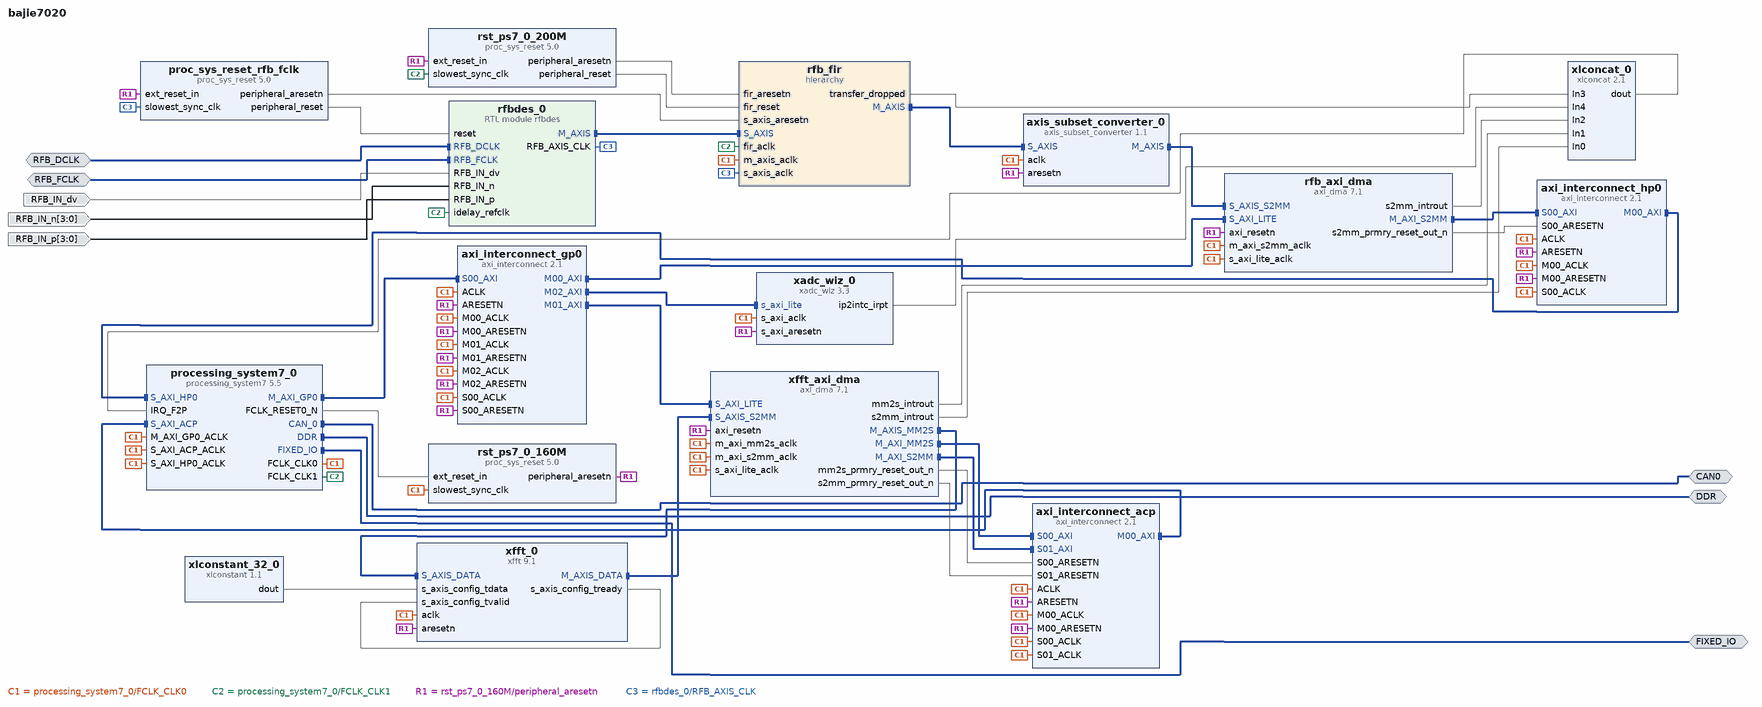
[diagram p0: block diagram of the top level]
# Vivado block design bajie7020, xc7z020clg400-1, Vivado 2022.1
create_bd_design bajie7020

create_bd_intf_port -mode Master -vlnv xilinx.com:interface:ddrx_rtl:1.0 DDR
create_bd_intf_port -mode Master -vlnv xilinx.com:display_processing_system7:fixedio_rtl:1.0 FIXED_IO
create_bd_intf_port -mode Master -vlnv xilinx.com:interface:can_rtl:1.0 CAN0
create_bd_intf_port -mode Slave -vlnv xilinx.com:interface:diff_clock_rtl:1.0 RFB_DCLK
set_property -dict {CONFIG.FREQ_HZ 144000000} [get_bd_intf_ports RFB_DCLK]
create_bd_intf_port -mode Slave -vlnv xilinx.com:interface:diff_clock_rtl:1.0 RFB_FCLK
set_property -dict {CONFIG.FREQ_HZ 48000000} [get_bd_intf_ports RFB_FCLK]
create_bd_port -dir I RFB_IN_dv
create_bd_port -dir I -from 3 -to 0 RFB_IN_n
create_bd_port -dir I -from 3 -to 0 RFB_IN_p

create_bd_cell -type ip -vlnv xilinx.com:ip:processing_system7:5.5 processing_system7_0
set_property -dict [list \
  CONFIG.PCW_APU_PERIPHERAL_FREQMHZ 666.666666 \
  CONFIG.PCW_CAN0_CAN0_IO EMIO \
  CONFIG.PCW_CAN0_PERIPHERAL_ENABLE 1 \
  CONFIG.PCW_CAN_PERIPHERAL_FREQMHZ 24 \
  CONFIG.PCW_CRYSTAL_PERIPHERAL_FREQMHZ 33.33333333 \
  CONFIG.PCW_ENET0_ENET0_IO {MIO 16 .. 27} \
  CONFIG.PCW_ENET0_GRP_MDIO_ENABLE 1 \
  CONFIG.PCW_ENET0_GRP_MDIO_IO {MIO 52 .. 53} \
  CONFIG.PCW_ENET0_PERIPHERAL_ENABLE 1 \
  CONFIG.PCW_ENET0_RESET_ENABLE 0 \
  CONFIG.PCW_ENET_RESET_ENABLE 1 \
  CONFIG.PCW_ENET_RESET_SELECT {Share reset pin} \
  CONFIG.PCW_EN_CLK1_PORT 1 \
  CONFIG.PCW_FCLK0_PERIPHERAL_CLKSRC {ARM PLL} \
  CONFIG.PCW_FCLK_CLK1_BUF TRUE \
  CONFIG.PCW_FPGA0_PERIPHERAL_FREQMHZ 133.33333333 \
  CONFIG.PCW_FPGA1_PERIPHERAL_FREQMHZ 200 \
  CONFIG.PCW_FPGA2_PERIPHERAL_FREQMHZ 100 \
  CONFIG.PCW_FPGA_FCLK1_ENABLE 1 \
  CONFIG.PCW_GPIO_EMIO_GPIO_ENABLE 1 \
  CONFIG.PCW_GPIO_EMIO_GPIO_IO 1 \
  CONFIG.PCW_GPIO_EMIO_GPIO_WIDTH 1 \
  CONFIG.PCW_GPIO_MIO_GPIO_ENABLE 1 \
  CONFIG.PCW_GPIO_MIO_GPIO_IO MIO \
  CONFIG.PCW_I2C_RESET_ENABLE 1 \
  CONFIG.PCW_IRQ_F2P_INTR 1 \
  CONFIG.PCW_PERIPHERAL_BOARD_PRESET None \
  CONFIG.PCW_PRESET_BANK1_VOLTAGE {LVCMOS 1.8V} \
  CONFIG.PCW_QSPI_PERIPHERAL_ENABLE 0 \
  CONFIG.PCW_SD0_GRP_CD_ENABLE 1 \
  CONFIG.PCW_SD0_GRP_CD_IO {MIO 47} \
  CONFIG.PCW_SD0_GRP_WP_ENABLE 0 \
  CONFIG.PCW_SD0_PERIPHERAL_ENABLE 1 \
  CONFIG.PCW_SD0_SD0_IO {MIO 40 .. 45} \
  CONFIG.PCW_SDIO_PERIPHERAL_FREQMHZ 50 \
  CONFIG.PCW_UART1_PERIPHERAL_ENABLE 1 \
  CONFIG.PCW_UART1_UART1_IO {MIO 12 .. 13} \
  CONFIG.PCW_UART_PERIPHERAL_FREQMHZ 100 \
  CONFIG.PCW_UIPARAM_DDR_BUS_WIDTH {16 Bit} \
  CONFIG.PCW_UIPARAM_DDR_FREQ_MHZ 400 \
  CONFIG.PCW_UIPARAM_DDR_PARTNO {MT41K256M16 RE-125} \
  CONFIG.PCW_USB0_PERIPHERAL_ENABLE 0 \
  CONFIG.PCW_USB_RESET_ENABLE 1 \
  CONFIG.PCW_USE_FABRIC_INTERRUPT 1 \
  CONFIG.PCW_USE_S_AXI_ACP 1 \
  CONFIG.PCW_USE_S_AXI_HP0 1 \
] [get_bd_cells processing_system7_0]
# 507 more settings of processing_system7_0 are not shown: defaults, MIO pin electricals, DDR timing, and values the tool derives
create_bd_cell -type ip -vlnv xilinx.com:ip:proc_sys_reset:5.0 rst_ps7_0_160M
create_bd_cell -type ip -vlnv xilinx.com:ip:xlconcat:2.1 xlconcat_0
set_property -dict {CONFIG.NUM_PORTS 5} [get_bd_cells xlconcat_0]
create_bd_cell -type ip -vlnv xilinx.com:ip:proc_sys_reset:5.0 proc_sys_reset_rfb_fclk
create_bd_cell -type ip -vlnv xilinx.com:ip:proc_sys_reset:5.0 rst_ps7_0_200M
create_bd_cell -type hier rfb_fir
create_bd_cell -type ip -vlnv xilinx.com:ip:xadc_wiz:3.3 xadc_wiz_0
set_property -dict [list \
  CONFIG.ADC_CONVERSION_RATE 1000 \
  CONFIG.ADC_OFFSET_CALIBRATION false \
  CONFIG.CHANNEL_ENABLE_TEMPERATURE true \
  CONFIG.CHANNEL_ENABLE_VCCAUX false \
  CONFIG.CHANNEL_ENABLE_VCCINT false \
  CONFIG.CHANNEL_ENABLE_VP_VN false \
  CONFIG.DCLK_FREQUENCY 160 \
  CONFIG.ENABLE_TEMP_BUS false \
  CONFIG.ENABLE_VBRAM_ALARM true \
  CONFIG.EXTERNAL_MUX_CHANNEL VP_VN \
  CONFIG.POWER_DOWN_ADCB false \
  CONFIG.SEQUENCER_MODE Off \
  CONFIG.SINGLE_CHANNEL_SELECTION TEMPERATURE \
  CONFIG.VCCDDRO_ALARM_UPPER 1.35 \
  CONFIG.VCCDDRO_VOLT 1_35 \
  CONFIG.XADC_STARUP_SELECTION simultaneous_sampling \
] [get_bd_cells xadc_wiz_0]
create_bd_cell -type ip -vlnv xilinx.com:ip:axi_dma:7.1 rfb_axi_dma
set_property -dict [list \
  CONFIG.c_include_mm2s 0 \
  CONFIG.c_include_sg 0 \
  CONFIG.c_m_axi_s2mm_data_width 64 \
  CONFIG.c_s_axis_s2mm_tdata_width 64 \
  CONFIG.c_sg_length_width 20 \
] [get_bd_cells rfb_axi_dma]
create_bd_cell -type ip -vlnv xilinx.com:ip:axi_dma:7.1 xfft_axi_dma
set_property -dict [list \
  CONFIG.c_include_sg 0 \
  CONFIG.c_m_axi_mm2s_data_width 64 \
  CONFIG.c_m_axi_s2mm_data_width 64 \
  CONFIG.c_m_axis_mm2s_tdata_width 64 \
  CONFIG.c_mm2s_burst_size 8 \
  CONFIG.c_s_axis_s2mm_tdata_width 64 \
  CONFIG.c_sg_length_width 20 \
] [get_bd_cells xfft_axi_dma]
create_bd_cell -type ip -vlnv xilinx.com:ip:axi_interconnect:2.1 axi_interconnect_gp0
set_property -dict {CONFIG.ENABLE_ADVANCED_OPTIONS 1 CONFIG.NUM_MI 3 CONFIG.NUM_SI 1} [get_bd_cells axi_interconnect_gp0]
create_bd_cell -type ip -vlnv xilinx.com:ip:axi_interconnect:2.1 axi_interconnect_acp
set_property -dict [list \
  CONFIG.ENABLE_ADVANCED_OPTIONS 1 \
  CONFIG.NUM_MI 1 \
  CONFIG.NUM_SI 2 \
  CONFIG.S00_ARB_PRIORITY 1 \
  CONFIG.S01_ARB_PRIORITY 2 \
  CONFIG.XBAR_DATA_WIDTH 64 \
] [get_bd_cells axi_interconnect_acp]
create_bd_cell -type ip -vlnv xilinx.com:ip:axi_interconnect:2.1 axi_interconnect_hp0
set_property -dict [list \
  CONFIG.ENABLE_ADVANCED_OPTIONS 1 \
  CONFIG.NUM_MI 1 \
  CONFIG.NUM_SI 1 \
  CONFIG.S00_HAS_DATA_FIFO 0 \
  CONFIG.XBAR_DATA_WIDTH 64 \
] [get_bd_cells axi_interconnect_hp0]
create_bd_cell -type ip -vlnv xilinx.com:ip:axis_subset_converter:1.1 axis_subset_converter_0
set_property -dict [list \
  CONFIG.M_HAS_TKEEP 1 \
  CONFIG.M_HAS_TLAST 1 \
  CONFIG.M_HAS_TREADY 1 \
  CONFIG.M_HAS_TSTRB 0 \
  CONFIG.M_TDATA_NUM_BYTES 8 \
  CONFIG.M_TDEST_WIDTH 0 \
  CONFIG.M_TID_WIDTH 0 \
  CONFIG.M_TUSER_WIDTH 0 \
  CONFIG.S_HAS_TKEEP 0 \
  CONFIG.S_HAS_TLAST 1 \
  CONFIG.S_HAS_TREADY 1 \
  CONFIG.S_HAS_TSTRB 0 \
  CONFIG.S_TDATA_NUM_BYTES 8 \
  CONFIG.S_TDEST_WIDTH 0 \
  CONFIG.S_TID_WIDTH 0 \
  CONFIG.S_TUSER_WIDTH 0 \
  CONFIG.TDATA_REMAP {tdata[63:0]} \
  CONFIG.TKEEP_REMAP {8'b11111111} \
  CONFIG.TLAST_REMAP {tlast[0]} \
] [get_bd_cells axis_subset_converter_0]
create_bd_cell -type ip -vlnv xilinx.com:ip:xfft:9.1 xfft_0
set_property -dict [list \
  CONFIG.aresetn true \
  CONFIG.channels 2 \
  CONFIG.complex_mult_type use_mults_resources \
  CONFIG.data_format fixed_point \
  CONFIG.implementation_options radix_4_burst_io \
  CONFIG.input_width 16 \
  CONFIG.memory_options_hybrid false \
  CONFIG.number_of_stages_using_block_ram_for_data_and_phase_factors 0 \
  CONFIG.output_ordering natural_order \
  CONFIG.phase_factor_width 16 \
  CONFIG.rounding_modes convergent_rounding \
  CONFIG.run_time_configurable_transform_length false \
  CONFIG.scaling_options scaled \
  CONFIG.target_clock_frequency 133 \
  CONFIG.target_data_throughput 50 \
  CONFIG.throttle_scheme nonrealtime \
  CONFIG.transform_length 4096 \
] [get_bd_cells xfft_0]
create_bd_cell -type ip -vlnv xilinx.com:ip:xlconstant:1.1 xlconstant_32_0
set_property -dict {CONFIG.CONST_VAL 0 CONFIG.CONST_WIDTH 32} [get_bd_cells xlconstant_32_0]
create_bd_cell -type module -reference rfbdes rfbdes_0
set_property -dict {CONFIG.din_idelay_tap 12} [get_bd_cells rfbdes_0]

# ---- hierarchy /rfb_fir ----
current_bd_instance /rfb_fir
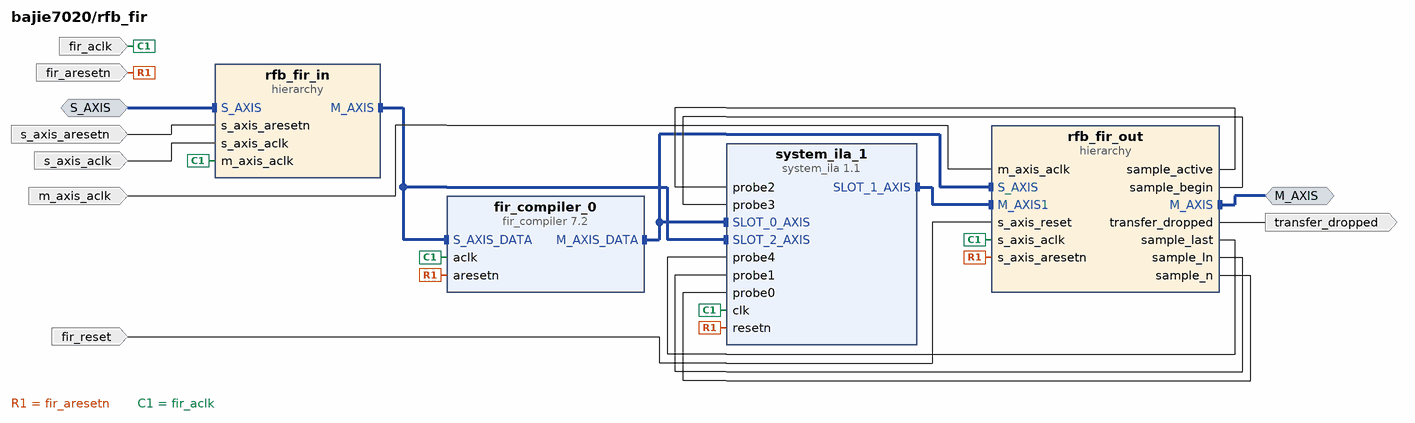
[diagram p1: block diagram inside /rfb_fir]
create_bd_intf_pin -mode Slave -vlnv xilinx.com:interface:axis_rtl:1.0 S_AXIS
create_bd_intf_pin -mode Master -vlnv xilinx.com:interface:axis_rtl:1.0 M_AXIS
create_bd_pin -dir I -type rst fir_aresetn
create_bd_pin -dir I -type clk fir_aclk
create_bd_pin -dir I -type clk m_axis_aclk
create_bd_pin -dir I -type clk s_axis_aclk
create_bd_pin -dir I -type rst s_axis_aresetn
create_bd_pin -dir O transfer_dropped
create_bd_pin -dir I -type rst fir_reset

create_bd_cell -type hier rfb_fir_out
create_bd_cell -type hier rfb_fir_in
create_bd_cell -type ip -vlnv xilinx.com:ip:fir_compiler:7.2 fir_compiler_0
set_property -dict [list \
  CONFIG.BestPrecision true \
  CONFIG.Clock_Frequency 200 \
  CONFIG.CoefficientSource COE_File \
  CONFIG.Coefficient_File ../../../../new/fir48Mt2M4.coe \
  CONFIG.Coefficient_Fractional_Bits 20 \
  CONFIG.Coefficient_Sets 1 \
  CONFIG.Coefficient_Sign Signed \
  CONFIG.Coefficient_Structure Inferred \
  CONFIG.Coefficient_Width 18 \
  CONFIG.ColumnConfig 8 \
  CONFIG.DATA_TUSER_Width 1 \
  CONFIG.Data_Fractional_Bits 0 \
  CONFIG.Data_Sign Signed \
  CONFIG.Data_Width 12 \
  CONFIG.Filter_Architecture Systolic_Multiply_Accumulate \
  CONFIG.Has_ACLKEN false \
  CONFIG.Has_ARESETn true \
  CONFIG.M_DATA_Has_TUSER User_Field \
  CONFIG.Number_Paths 2 \
  CONFIG.Output_Rounding_Mode Truncate_LSBs \
  CONFIG.Output_Width 32 \
  CONFIG.Quantization Maximize_Dynamic_Range \
  CONFIG.Reset_Data_Vector false \
  CONFIG.S_DATA_Has_FIFO false \
  CONFIG.S_DATA_Has_TUSER User_Field \
  CONFIG.Sample_Frequency 48 \
] [get_bd_cells fir_compiler_0]
create_bd_cell -type ip -vlnv xilinx.com:ip:system_ila:1.1 system_ila_1
set_property -dict [list \
  CONFIG.ALL_PROBE_SAME_MU_CNT 2 \
  CONFIG.C_DATA_DEPTH 4096 \
  CONFIG.C_EN_STRG_QUAL 1 \
  CONFIG.C_MON_TYPE MIX \
  CONFIG.C_NUM_MONITOR_SLOTS 3 \
  CONFIG.C_NUM_OF_PROBES 5 \
  CONFIG.C_PROBE0_MU_CNT 2 \
  CONFIG.C_PROBE1_MU_CNT 2 \
  CONFIG.C_PROBE2_MU_CNT 2 \
  CONFIG.C_PROBE3_MU_CNT 2 \
  CONFIG.C_PROBE4_MU_CNT 2 \
  CONFIG.C_PROBE5_MU_CNT 2 \
  CONFIG.C_SLOT 2 \
  CONFIG.C_SLOT_0_INTF_TYPE xilinx.com:interface:axis_rtl:1.0 \
  CONFIG.C_SLOT_1_INTF_TYPE xilinx.com:interface:axis_rtl:1.0 \
  CONFIG.C_SLOT_2_INTF_TYPE xilinx.com:interface:axis_rtl:1.0 \
] [get_bd_cells system_ila_1]

# ---- hierarchy /rfb_fir/rfb_fir_out ----
current_bd_instance /rfb_fir/rfb_fir_out
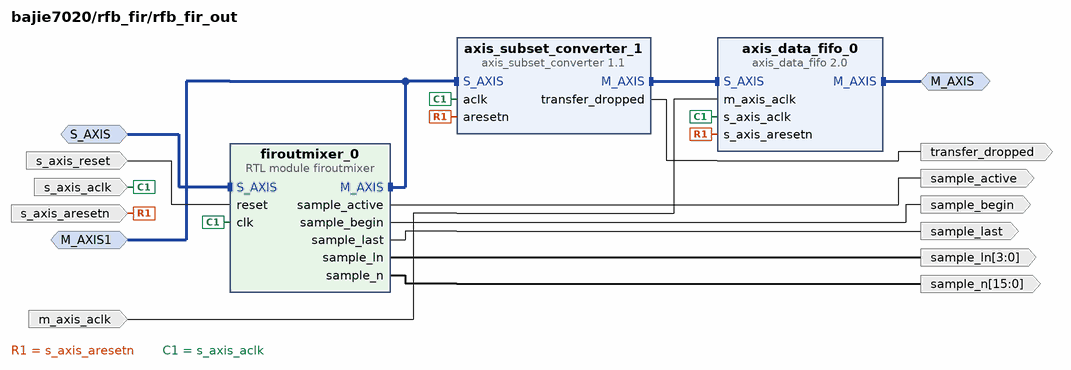
[diagram p2: block diagram inside /rfb_fir/rfb_fir_out]
create_bd_intf_pin -mode Slave -vlnv xilinx.com:interface:axis_rtl:1.0 S_AXIS
create_bd_intf_pin -mode Master -vlnv xilinx.com:interface:axis_rtl:1.0 M_AXIS
create_bd_intf_pin -mode Monitor -vlnv xilinx.com:interface:axis_rtl:1.0 M_AXIS1
create_bd_pin -dir I -type clk s_axis_aclk
create_bd_pin -dir I -type rst s_axis_aresetn
create_bd_pin -dir I -type clk m_axis_aclk
create_bd_pin -dir O transfer_dropped
create_bd_pin -dir I -type rst s_axis_reset
create_bd_pin -dir O sample_last
create_bd_pin -dir O sample_active
create_bd_pin -dir O sample_begin
create_bd_pin -dir O -from 15 -to 0 sample_n
create_bd_pin -dir O -from 3 -to 0 sample_ln

create_bd_cell -type ip -vlnv xilinx.com:ip:axis_data_fifo:2.0 axis_data_fifo_0
set_property -dict [list \
  CONFIG.FIFO_DEPTH 1024 \
  CONFIG.HAS_TKEEP 0 \
  CONFIG.HAS_TLAST 1 \
  CONFIG.HAS_TSTRB 0 \
  CONFIG.IS_ACLK_ASYNC 1 \
  CONFIG.TDATA_NUM_BYTES 8 \
  CONFIG.TDEST_WIDTH 0 \
  CONFIG.TID_WIDTH 0 \
  CONFIG.TUSER_WIDTH 0 \
] [get_bd_cells axis_data_fifo_0]
create_bd_cell -type ip -vlnv xilinx.com:ip:axis_subset_converter:1.1 axis_subset_converter_1
set_property -dict [list \
  CONFIG.M_HAS_TKEEP 0 \
  CONFIG.M_HAS_TLAST 1 \
  CONFIG.M_HAS_TREADY 1 \
  CONFIG.M_HAS_TSTRB 0 \
  CONFIG.M_TDATA_NUM_BYTES 8 \
  CONFIG.M_TDEST_WIDTH 0 \
  CONFIG.M_TID_WIDTH 0 \
  CONFIG.M_TUSER_WIDTH 0 \
  CONFIG.S_HAS_TKEEP 0 \
  CONFIG.S_HAS_TLAST 1 \
  CONFIG.S_HAS_TREADY 0 \
  CONFIG.S_HAS_TSTRB 0 \
  CONFIG.S_TDATA_NUM_BYTES 8 \
  CONFIG.S_TDEST_WIDTH 0 \
  CONFIG.S_TID_WIDTH 0 \
  CONFIG.S_TUSER_WIDTH 0 \
  CONFIG.TDATA_REMAP {tdata[63:0]} \
  CONFIG.TLAST_REMAP {tlast[0]} \
] [get_bd_cells axis_subset_converter_1]
create_bd_cell -type module -reference firoutmixer firoutmixer_0

# ---- hierarchy /rfb_fir/rfb_fir_in ----
current_bd_instance /rfb_fir/rfb_fir_in
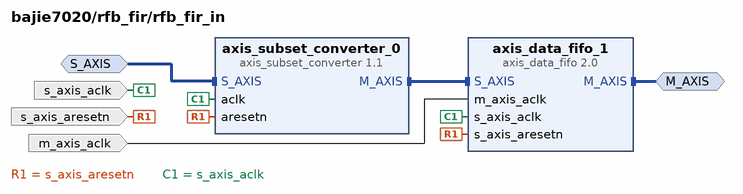
[diagram p3: block diagram inside /rfb_fir/rfb_fir_in]
create_bd_intf_pin -mode Slave -vlnv xilinx.com:interface:axis_rtl:1.0 S_AXIS
create_bd_intf_pin -mode Master -vlnv xilinx.com:interface:axis_rtl:1.0 M_AXIS
create_bd_pin -dir I -type clk s_axis_aclk
create_bd_pin -dir I -type rst s_axis_aresetn
create_bd_pin -dir I -type clk m_axis_aclk

create_bd_cell -type ip -vlnv xilinx.com:ip:axis_data_fifo:2.0 axis_data_fifo_1
set_property -dict {CONFIG.FIFO_DEPTH 16 CONFIG.FIFO_MEMORY_TYPE auto CONFIG.IS_ACLK_ASYNC 1} [get_bd_cells axis_data_fifo_1]
create_bd_cell -type ip -vlnv xilinx.com:ip:axis_subset_converter:1.1 axis_subset_converter_0
set_property -dict [list \
  CONFIG.M_HAS_TKEEP 0 \
  CONFIG.M_HAS_TLAST 0 \
  CONFIG.M_HAS_TREADY 1 \
  CONFIG.M_HAS_TSTRB 0 \
  CONFIG.M_TDATA_NUM_BYTES 4 \
  CONFIG.M_TDEST_WIDTH 0 \
  CONFIG.M_TID_WIDTH 0 \
  CONFIG.M_TUSER_WIDTH 1 \
  CONFIG.S_HAS_TKEEP 0 \
  CONFIG.S_HAS_TLAST 0 \
  CONFIG.S_HAS_TREADY 0 \
  CONFIG.S_HAS_TSTRB 0 \
  CONFIG.S_TDATA_NUM_BYTES 3 \
  CONFIG.S_TDEST_WIDTH 0 \
  CONFIG.S_TID_WIDTH 0 \
  CONFIG.S_TUSER_WIDTH 1 \
  CONFIG.TDATA_REMAP {4'b0000,tdata[23:12],4'b0000,tdata[11:0]} \
  CONFIG.TKEEP_REMAP {1'b0} \
  CONFIG.TLAST_REMAP {1'b0} \
  CONFIG.TUSER_REMAP {tuser[0:0]} \
] [get_bd_cells axis_subset_converter_0]

# ---- connections ----

current_bd_instance /rfb_fir
connect_bd_intf_net [get_bd_intf_pins system_ila_1/SLOT_1_AXIS] [get_bd_intf_pins rfb_fir_out/M_AXIS1]
connect_bd_intf_net [get_bd_intf_pins M_AXIS] [get_bd_intf_pins rfb_fir_out/M_AXIS]
connect_bd_intf_net -intf_net axis_data_fifo_1_M_AXIS [get_bd_intf_pins rfb_fir_in/M_AXIS] [get_bd_intf_pins fir_compiler_0/S_AXIS_DATA]
connect_bd_intf_net [get_bd_intf_pins rfb_fir_in/M_AXIS] [get_bd_intf_pins system_ila_1/SLOT_2_AXIS]
connect_bd_intf_net [get_bd_intf_pins fir_compiler_0/M_AXIS_DATA] [get_bd_intf_pins rfb_fir_out/S_AXIS]
connect_bd_intf_net [get_bd_intf_pins fir_compiler_0/M_AXIS_DATA] [get_bd_intf_pins system_ila_1/SLOT_0_AXIS]
connect_bd_intf_net -intf_net rfbdes_0_M_AXIS [get_bd_intf_pins S_AXIS] [get_bd_intf_pins rfb_fir_in/S_AXIS]
connect_bd_net -net proc_sys_reset_rfb_288M_peripheral_aresetn [get_bd_pins fir_aresetn] \
  [get_bd_pins rfb_fir_out/s_axis_aresetn] [get_bd_pins fir_compiler_0/aresetn] [get_bd_pins system_ila_1/resetn]
connect_bd_net -net proc_sys_reset_rfb_fclk_peripheral_aresetn [get_bd_pins s_axis_aresetn] [get_bd_pins rfb_fir_in/s_axis_aresetn]
connect_bd_net -net processing_system7_0_FCLK_CLK0 [get_bd_pins m_axis_aclk] [get_bd_pins rfb_fir_out/m_axis_aclk]
connect_bd_net -net processing_system7_0_FCLK_CLK1 [get_bd_pins fir_aclk] \
  [get_bd_pins rfb_fir_in/m_axis_aclk] [get_bd_pins rfb_fir_out/s_axis_aclk] [get_bd_pins fir_compiler_0/aclk] \
  [get_bd_pins system_ila_1/clk]
connect_bd_net -net reset_1 [get_bd_pins fir_reset] [get_bd_pins rfb_fir_out/s_axis_reset]
connect_bd_net [get_bd_pins rfb_fir_out/sample_active] [get_bd_pins system_ila_1/probe2]
connect_bd_net [get_bd_pins rfb_fir_out/sample_begin] [get_bd_pins system_ila_1/probe3]
connect_bd_net [get_bd_pins rfb_fir_out/sample_last] [get_bd_pins system_ila_1/probe4]
connect_bd_net [get_bd_pins rfb_fir_out/sample_ln] [get_bd_pins system_ila_1/probe1]
connect_bd_net [get_bd_pins rfb_fir_out/sample_n] [get_bd_pins system_ila_1/probe0]
connect_bd_net [get_bd_pins rfb_fir_out/transfer_dropped] [get_bd_pins transfer_dropped]
connect_bd_net -net util_ds_buf_rfb_fclk_IBUF_OUT [get_bd_pins s_axis_aclk] [get_bd_pins rfb_fir_in/s_axis_aclk]

current_bd_instance /rfb_fir/rfb_fir_out
connect_bd_intf_net [get_bd_intf_pins M_AXIS] [get_bd_intf_pins axis_data_fifo_0/M_AXIS]
connect_bd_intf_net [get_bd_intf_pins axis_data_fifo_0/S_AXIS] [get_bd_intf_pins axis_subset_converter_1/M_AXIS]
connect_bd_intf_net -intf_net fir_compiler_0_M_AXIS_DATA [get_bd_intf_pins S_AXIS] [get_bd_intf_pins firoutmixer_0/S_AXIS]
connect_bd_intf_net [get_bd_intf_pins firoutmixer_0/M_AXIS] [get_bd_intf_pins axis_subset_converter_1/S_AXIS]
connect_bd_intf_net [get_bd_intf_pins firoutmixer_0/M_AXIS] [get_bd_intf_pins M_AXIS1]
connect_bd_net [get_bd_pins axis_subset_converter_1/transfer_dropped] [get_bd_pins transfer_dropped]
connect_bd_net [get_bd_pins firoutmixer_0/sample_active] [get_bd_pins sample_active]
connect_bd_net [get_bd_pins firoutmixer_0/sample_begin] [get_bd_pins sample_begin]
connect_bd_net [get_bd_pins firoutmixer_0/sample_last] [get_bd_pins sample_last]
connect_bd_net [get_bd_pins firoutmixer_0/sample_ln] [get_bd_pins sample_ln]
connect_bd_net [get_bd_pins firoutmixer_0/sample_n] [get_bd_pins sample_n]
connect_bd_net -net proc_sys_reset_rfb_288M_peripheral_aresetn [get_bd_pins s_axis_aresetn] \
  [get_bd_pins axis_data_fifo_0/s_axis_aresetn] [get_bd_pins axis_subset_converter_1/aresetn]
connect_bd_net -net processing_system7_0_FCLK_CLK0 [get_bd_pins m_axis_aclk] [get_bd_pins axis_data_fifo_0/m_axis_aclk]
connect_bd_net -net processing_system7_0_FCLK_CLK1 [get_bd_pins s_axis_aclk] \
  [get_bd_pins axis_data_fifo_0/s_axis_aclk] [get_bd_pins axis_subset_converter_1/aclk] [get_bd_pins firoutmixer_0/clk]
connect_bd_net -net reset_1 [get_bd_pins s_axis_reset] [get_bd_pins firoutmixer_0/reset]

current_bd_instance /rfb_fir/rfb_fir_in
connect_bd_intf_net [get_bd_intf_pins M_AXIS] [get_bd_intf_pins axis_data_fifo_1/M_AXIS]
connect_bd_intf_net [get_bd_intf_pins axis_data_fifo_1/S_AXIS] [get_bd_intf_pins axis_subset_converter_0/M_AXIS]
connect_bd_intf_net -intf_net rfbdes_0_M_AXIS [get_bd_intf_pins S_AXIS] [get_bd_intf_pins axis_subset_converter_0/S_AXIS]
connect_bd_net -net proc_sys_reset_rfb_fclk_peripheral_aresetn [get_bd_pins s_axis_aresetn] \
  [get_bd_pins axis_data_fifo_1/s_axis_aresetn] [get_bd_pins axis_subset_converter_0/aresetn]
connect_bd_net -net processing_system7_0_FCLK_CLK1 [get_bd_pins m_axis_aclk] [get_bd_pins axis_data_fifo_1/m_axis_aclk]
connect_bd_net -net util_ds_buf_rfb_fclk_IBUF_OUT [get_bd_pins s_axis_aclk] \
  [get_bd_pins axis_data_fifo_1/s_axis_aclk] [get_bd_pins axis_subset_converter_0/aclk]

current_bd_instance /
connect_bd_intf_net [get_bd_intf_ports RFB_DCLK] [get_bd_intf_pins rfbdes_0/RFB_DCLK]
connect_bd_intf_net [get_bd_intf_ports RFB_FCLK] [get_bd_intf_pins rfbdes_0/RFB_FCLK]
connect_bd_intf_net [get_bd_intf_pins axi_interconnect_gp0/S00_AXI] [get_bd_intf_pins processing_system7_0/M_AXI_GP0]
connect_bd_intf_net [get_bd_intf_pins axi_interconnect_hp0/S00_AXI] [get_bd_intf_pins rfb_axi_dma/M_AXI_S2MM]
connect_bd_intf_net -intf_net axi_dma_1_M_AXIS_MM2S [get_bd_intf_pins xfft_0/S_AXIS_DATA] [get_bd_intf_pins xfft_axi_dma/M_AXIS_MM2S]
connect_bd_intf_net -intf_net axi_dma_1_M_AXI_MM2S [get_bd_intf_pins xfft_axi_dma/M_AXI_MM2S] [get_bd_intf_pins axi_interconnect_acp/S00_AXI]
connect_bd_intf_net -intf_net axi_dma_1_M_AXI_S2MM [get_bd_intf_pins xfft_axi_dma/M_AXI_S2MM] [get_bd_intf_pins axi_interconnect_acp/S01_AXI]
connect_bd_intf_net -intf_net axi_interconnect_0_M00_AXI [get_bd_intf_pins axi_interconnect_gp0/M00_AXI] [get_bd_intf_pins rfb_axi_dma/S_AXI_LITE]
connect_bd_intf_net -intf_net axi_interconnect_0_M01_AXI [get_bd_intf_pins xfft_axi_dma/S_AXI_LITE] [get_bd_intf_pins axi_interconnect_gp0/M01_AXI]
connect_bd_intf_net -intf_net axi_interconnect_1_M00_AXI [get_bd_intf_pins axi_interconnect_acp/M00_AXI] [get_bd_intf_pins processing_system7_0/S_AXI_ACP]
connect_bd_intf_net [get_bd_intf_pins axi_interconnect_gp0/M02_AXI] [get_bd_intf_pins xadc_wiz_0/s_axi_lite]
connect_bd_intf_net -intf_net axi_mem_intercon_M00_AXI [get_bd_intf_pins axi_interconnect_hp0/M00_AXI] [get_bd_intf_pins processing_system7_0/S_AXI_HP0]
connect_bd_intf_net [get_bd_intf_pins rfb_axi_dma/S_AXIS_S2MM] [get_bd_intf_pins axis_subset_converter_0/M_AXIS]
connect_bd_intf_net [get_bd_intf_ports CAN0] [get_bd_intf_pins processing_system7_0/CAN_0]
connect_bd_intf_net [get_bd_intf_ports DDR] [get_bd_intf_pins processing_system7_0/DDR]
connect_bd_intf_net [get_bd_intf_ports FIXED_IO] [get_bd_intf_pins processing_system7_0/FIXED_IO]
connect_bd_intf_net [get_bd_intf_pins axis_subset_converter_0/S_AXIS] [get_bd_intf_pins rfb_fir/M_AXIS]
connect_bd_intf_net [get_bd_intf_pins rfbdes_0/M_AXIS] [get_bd_intf_pins rfb_fir/S_AXIS]
connect_bd_intf_net [get_bd_intf_pins xfft_0/M_AXIS_DATA] [get_bd_intf_pins xfft_axi_dma/S_AXIS_S2MM]
connect_bd_net -net RFB_DATAVALID_1 [get_bd_ports RFB_IN_dv] [get_bd_pins rfbdes_0/RFB_IN_dv]
connect_bd_net -net RFB_IN_n_0_1 [get_bd_ports RFB_IN_n] [get_bd_pins rfbdes_0/RFB_IN_n]
connect_bd_net -net RFB_IN_p_0_1 [get_bd_ports RFB_IN_p] [get_bd_pins rfbdes_0/RFB_IN_p]
connect_bd_net -net axi_dma_1_mm2s_introut [get_bd_pins xfft_axi_dma/mm2s_introut] [get_bd_pins xlconcat_0/In1]
connect_bd_net -net axi_dma_1_mm2s_prmry_reset_out_n [get_bd_pins xfft_axi_dma/mm2s_prmry_reset_out_n] [get_bd_pins axi_interconnect_acp/S00_ARESETN]
connect_bd_net -net axi_dma_1_s2mm_introut [get_bd_pins xfft_axi_dma/s2mm_introut] [get_bd_pins xlconcat_0/In0]
connect_bd_net -net axi_dma_1_s2mm_prmry_reset_out_n [get_bd_pins xfft_axi_dma/s2mm_prmry_reset_out_n] [get_bd_pins axi_interconnect_acp/S01_ARESETN]
connect_bd_net -net hdmi_axi_dma_0_s2mm_introut [get_bd_pins rfb_axi_dma/s2mm_introut] [get_bd_pins xlconcat_0/In2]
connect_bd_net -net hdmi_axi_dma_0_s2mm_prmry_reset_out_n [get_bd_pins rfb_axi_dma/s2mm_prmry_reset_out_n] \
  [get_bd_pins axi_interconnect_hp0/S00_ARESETN]
connect_bd_net -net proc_sys_reset_rfb_288M_peripheral_aresetn [get_bd_pins rst_ps7_0_200M/peripheral_aresetn] [get_bd_pins rfb_fir/fir_aresetn]
connect_bd_net [get_bd_pins proc_sys_reset_rfb_fclk/peripheral_aresetn] [get_bd_pins rfb_fir/s_axis_aresetn]
connect_bd_net [get_bd_pins proc_sys_reset_rfb_fclk/peripheral_reset] [get_bd_pins rfbdes_0/reset]
connect_bd_net [get_bd_pins processing_system7_0/FCLK_CLK0] \
  [get_bd_pins rst_ps7_0_160M/slowest_sync_clk] [get_bd_pins processing_system7_0/S_AXI_ACP_ACLK] \
  [get_bd_pins processing_system7_0/M_AXI_GP0_ACLK] [get_bd_pins rfb_fir/m_axis_aclk] \
  [get_bd_pins processing_system7_0/S_AXI_HP0_ACLK] [get_bd_pins xadc_wiz_0/s_axi_aclk] \
  [get_bd_pins rfb_axi_dma/s_axi_lite_aclk] [get_bd_pins rfb_axi_dma/m_axi_s2mm_aclk] \
  [get_bd_pins xfft_axi_dma/s_axi_lite_aclk] [get_bd_pins xfft_axi_dma/m_axi_mm2s_aclk] \
  [get_bd_pins xfft_axi_dma/m_axi_s2mm_aclk] [get_bd_pins axi_interconnect_gp0/ACLK] \
  [get_bd_pins axi_interconnect_gp0/S00_ACLK] [get_bd_pins axi_interconnect_gp0/M00_ACLK] \
  [get_bd_pins axi_interconnect_gp0/M01_ACLK] [get_bd_pins axi_interconnect_gp0/M02_ACLK] \
  [get_bd_pins axi_interconnect_acp/ACLK] [get_bd_pins axi_interconnect_acp/S00_ACLK] \
  [get_bd_pins axi_interconnect_acp/M00_ACLK] [get_bd_pins axi_interconnect_acp/S01_ACLK] \
  [get_bd_pins axi_interconnect_hp0/ACLK] [get_bd_pins axi_interconnect_hp0/S00_ACLK] \
  [get_bd_pins axi_interconnect_hp0/M00_ACLK] [get_bd_pins axis_subset_converter_0/aclk] [get_bd_pins xfft_0/aclk]
connect_bd_net [get_bd_pins processing_system7_0/FCLK_CLK1] \
  [get_bd_pins rst_ps7_0_200M/slowest_sync_clk] [get_bd_pins rfb_fir/fir_aclk] [get_bd_pins rfbdes_0/idelay_refclk]
connect_bd_net [get_bd_pins processing_system7_0/FCLK_RESET0_N] [get_bd_pins rst_ps7_0_160M/ext_reset_in]
connect_bd_net [get_bd_pins rfb_fir/transfer_dropped] [get_bd_pins xlconcat_0/In3]
connect_bd_net [get_bd_pins rst_ps7_0_160M/peripheral_aresetn] \
  [get_bd_pins proc_sys_reset_rfb_fclk/ext_reset_in] [get_bd_pins rst_ps7_0_200M/ext_reset_in] \
  [get_bd_pins xadc_wiz_0/s_axi_aresetn] [get_bd_pins rfb_axi_dma/axi_resetn] [get_bd_pins xfft_axi_dma/axi_resetn] \
  [get_bd_pins axi_interconnect_gp0/ARESETN] [get_bd_pins axi_interconnect_gp0/S00_ARESETN] \
  [get_bd_pins axi_interconnect_gp0/M00_ARESETN] [get_bd_pins axi_interconnect_gp0/M01_ARESETN] \
  [get_bd_pins axi_interconnect_gp0/M02_ARESETN] [get_bd_pins axi_interconnect_acp/ARESETN] \
  [get_bd_pins axi_interconnect_acp/M00_ARESETN] [get_bd_pins axi_interconnect_hp0/ARESETN] \
  [get_bd_pins axi_interconnect_hp0/M00_ARESETN] [get_bd_pins axis_subset_converter_0/aresetn] [get_bd_pins xfft_0/aresetn]
connect_bd_net [get_bd_pins rst_ps7_0_200M/peripheral_reset] [get_bd_pins rfb_fir/fir_reset]
connect_bd_net -net util_ds_buf_rfb_fclk_IBUF_OUT [get_bd_pins rfbdes_0/RFB_AXIS_CLK] \
  [get_bd_pins proc_sys_reset_rfb_fclk/slowest_sync_clk] [get_bd_pins rfb_fir/s_axis_aclk]
connect_bd_net [get_bd_pins xadc_wiz_0/ip2intc_irpt] [get_bd_pins xlconcat_0/In4]
connect_bd_net [get_bd_pins xfft_0/s_axis_config_tready] [get_bd_pins xfft_0/s_axis_config_tvalid]
connect_bd_net [get_bd_pins xlconcat_0/dout] [get_bd_pins processing_system7_0/IRQ_F2P]
connect_bd_net -net xlconstant_0_dout [get_bd_pins xlconstant_32_0/dout] [get_bd_pins xfft_0/s_axis_config_tdata]

# ---- address map ----
assign_bd_address -offset 0x40400000 -range 64K -target_address_space [get_bd_addr_spaces processing_system7_0/Data] [get_bd_addr_segs xfft_axi_dma/S_AXI_LITE/Reg]
assign_bd_address -offset 0x40410000 -range 64K -target_address_space [get_bd_addr_spaces processing_system7_0/Data] [get_bd_addr_segs rfb_axi_dma/S_AXI_LITE/Reg]
assign_bd_address -offset 0x43C00000 -range 64K -target_address_space [get_bd_addr_spaces processing_system7_0/Data] [get_bd_addr_segs xadc_wiz_0/s_axi_lite/Reg]
assign_bd_address -offset 0x00000000 -range 512M -target_address_space [get_bd_addr_spaces rfb_axi_dma/Data_S2MM] [get_bd_addr_segs processing_system7_0/S_AXI_HP0/HP0_DDR_LOWOCM]
assign_bd_address -offset 0x00000000 -range 512M -target_address_space [get_bd_addr_spaces xfft_axi_dma/Data_MM2S] [get_bd_addr_segs processing_system7_0/S_AXI_ACP/ACP_DDR_LOWOCM]
exclude_bd_addr_seg -offset 0x40000000 -range 1G -target_address_space [get_bd_addr_spaces xfft_axi_dma/Data_MM2S] [get_bd_addr_segs processing_system7_0/S_AXI_ACP/ACP_M_AXI_GP0]
exclude_bd_addr_seg -offset 0xE0000000 -range 4M -target_address_space [get_bd_addr_spaces xfft_axi_dma/Data_MM2S] [get_bd_addr_segs processing_system7_0/S_AXI_ACP/ACP_IOP]
assign_bd_address -offset 0x00000000 -range 512M -target_address_space [get_bd_addr_spaces xfft_axi_dma/Data_S2MM] [get_bd_addr_segs processing_system7_0/S_AXI_ACP/ACP_DDR_LOWOCM]
exclude_bd_addr_seg -offset 0x40000000 -range 1G -target_address_space [get_bd_addr_spaces xfft_axi_dma/Data_S2MM] [get_bd_addr_segs processing_system7_0/S_AXI_ACP/ACP_M_AXI_GP0]
exclude_bd_addr_seg -offset 0xE0000000 -range 4M -target_address_space [get_bd_addr_spaces xfft_axi_dma/Data_S2MM] [get_bd_addr_segs processing_system7_0/S_AXI_ACP/ACP_IOP]

validate_bd_design
save_bd_design
